# EAGLE design tweeq-eMod_IR (EAGLE 7.2.0)
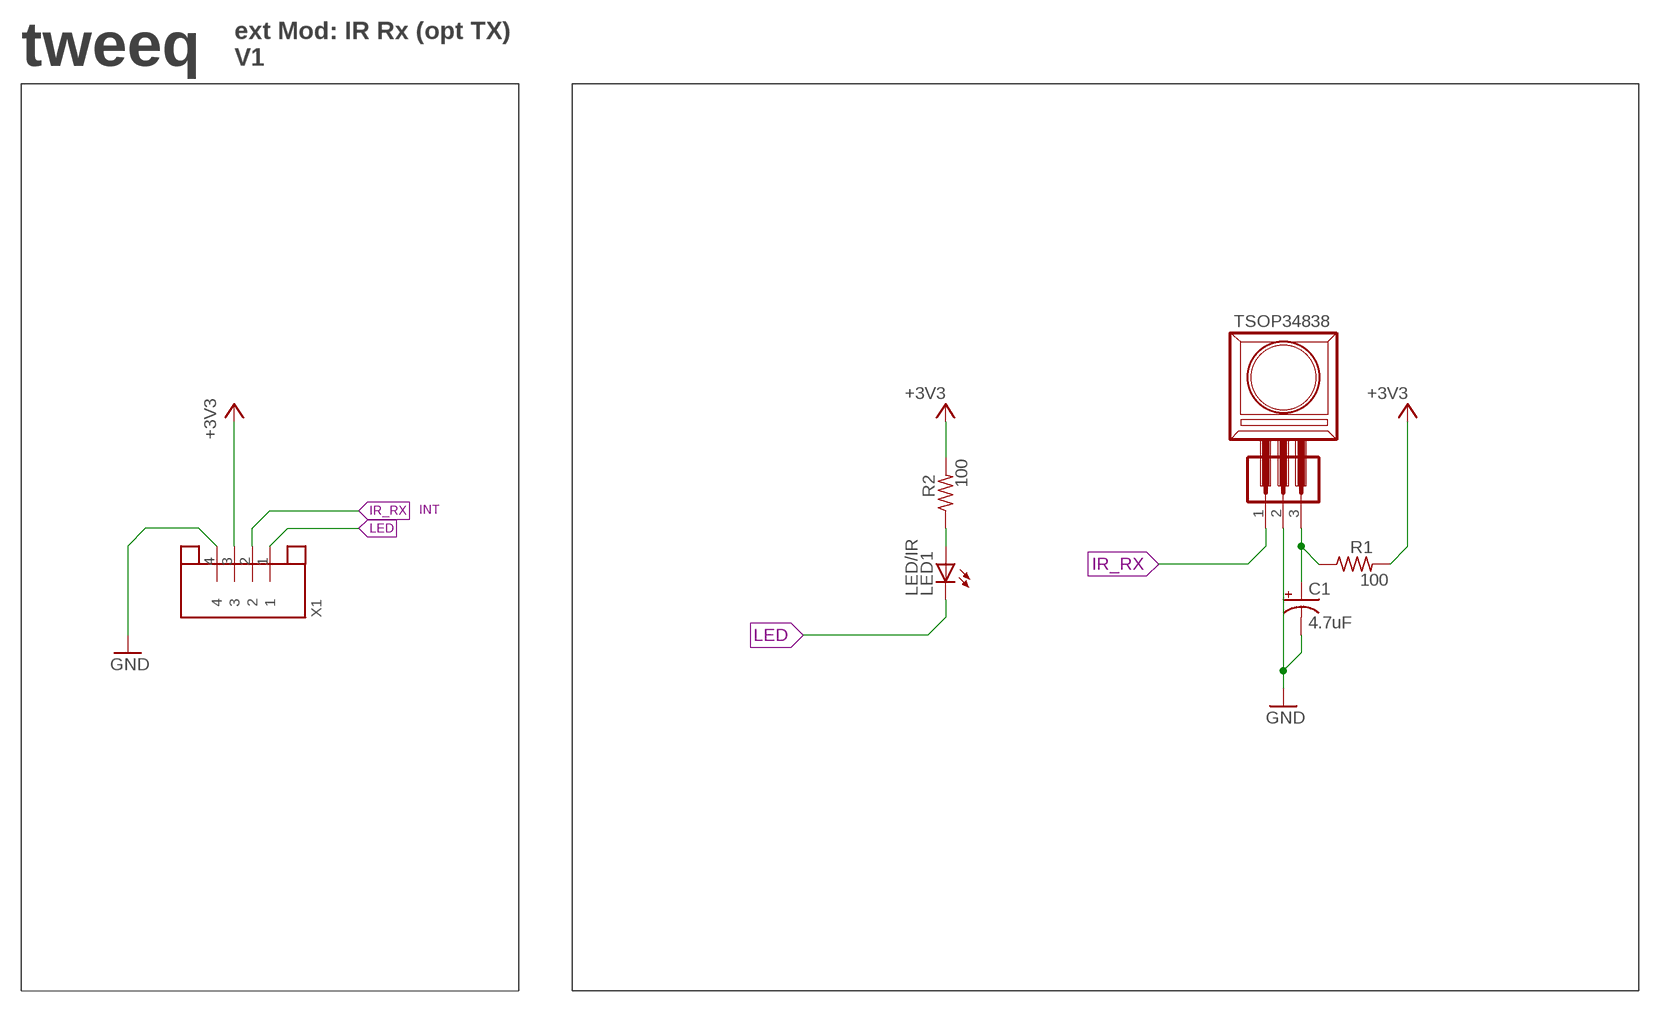
[diagram p0: schematic, sheet 1]

## Parts
C1  4.7uF  CPOL-USSMCA  [SMC_A]
LED1  LED/IR  LEDCHIPLED_0805  [CHIPLED_0805]
R1  100  R-US_R0603  [R0603]
R2  100  R-US_R0603  [R0603]
TSOP34838  M03NS-SQ  [1X03-NS-SQ]
X1  JST-4PINSH  [SH1.0-4PIN]

## Nets
+3V3: R1.2 R2.2 X1.3
GND: C1.- TSOP34838.2 X1.4
IR_RX: TSOP34838.1 X1.2
LED: LED1.C X1.1
N$1: LED1.A R2.1
N$5: C1.+ R1.1 TSOP34838.3

## Notes on the sheet
- tweeq
- ext Mod: IR Rx (opt TX)
  V1
- INT

## Library data of the parts
C1 = AISCube:CPOL-US: POLARIZED CAPACITOR, American symbol
LED1 = AISCube:LED: LED OSRAM: - CHIPLED LG R971, LG N971, LY N971, LG Q971, LY Q971, LO R971, LY R971 LH N974, LH R974 LS Q976, LO Q976, LY Q976 LO Q996 - Hyper CHIPLED LW Q18S LB Q993, LB Q99A, LB R99A - SideLED LS A670, LO A670, LY A670, LG A670, LP A670 LB A673, LV A673, LT A673, LW A673 LH A674 LY A675 LS A676, LA A676, LO A676, LY A676, LW A676 LS A679, LY A679, LG A679 - Hyper Micro SIDELED® LS Y876, LA Y876, LO Y876, LY Y876 LT Y87S - SmartLED LW L88C, LW L88S LB L89C, LB L89S, LG L890 LS L89K, LO L89K, LY L89K LS L896, LA L896, LO L896, LY L896 - TOPLED LS T670, LO T670, LY T670, LG T670, LP T670 LSG T670, LSP T670, LSY T670, LOP T670, LYG T670 LG T671, LOG T671, LSG T671 LB T673, LV T673, LT T673, LW T673 LH T674 LS T676, LA T676, LO T676, LY T676, LB T676, LH T676, LSB T676, LW T676 LB T67C, LV T67C, LT T67C, LS T67K, LO T67K, LY T67K, LW E67C LS E67B, LA E67B, LO E67B, LY E67B, LB E67C, LV E67C, LT E67C LW T67C LS T679, LY T679, LG T679 LS T770, LO T770, LY T770, LG T770, LP T770 LB T773, LV T773, LT T773, LW T773 LH T774 LS E675, LA E675, LY E675, LS T675 LS T776, LA T776, LO T776, LY T776, LB T776 LHGB T686 LT T68C, LB T68C - Hyper Mini TOPLED® LB M676 - Mini TOPLED Santana® LG M470 LS M47K, LO M47K, LY M47K Source: http://www.osram.convergy.de/
R1 R2 = rcl:R-US_: RESISTOR, American symbol
TSOP34838 = AISCube:M03: Header 3 Standard 3-pin 0.1" header
X1 = AISCube:JST-4PIN: JST 4 Pin

## Board
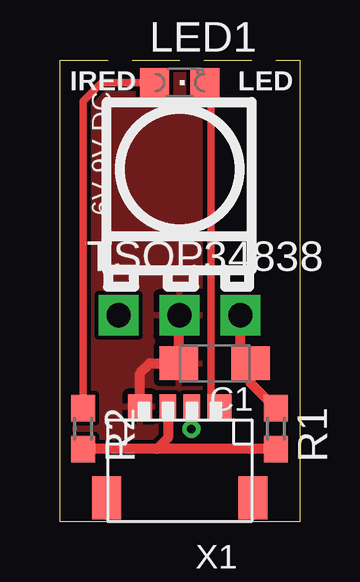
[diagram p1: board, top side]
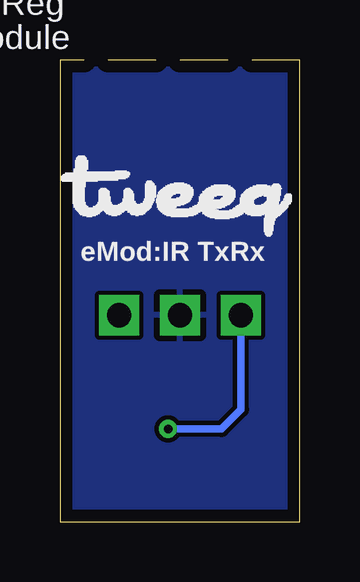
[diagram p2: board, bottom side, seen from below]

Size 10 x 19.25 mm. Coordinates in mm from the lower left corner, seen from the top.
Outline: 0,19.25 10,19.25 10,0 0,0 0,19.25
Copper layers (1*16): Top 0.0356mm / dielectric 1.5011mm / Bottom 0.0356mm
Design rules "AISCube": minimum track width 7mil, minimum drill 14mil, track to track 7mil, track to pad 7mil, pad to pad 7mil, via to via 7mil, smd to smd 0mil, copper to edge 20mil, drill to drill 8mil, minimum pad ring 10mil, minimum via ring 8mil, stop-mask expansion 4mil, vias tented up to drill 32mil, thermal gap 10mil

### Footprints (pad centres in the part's own frame; a part is rotated, then mirrored left to right if it is on the bottom)
SMC_A = smd 1.6 x 1.4: + -1.5,0; - 1.5,0
CHIPLED_0805 = smd 1.2 x 1.2: A 0,-1.05; C 0,1.05
R0603 = smd 1.1 x 1: 1 -0.85,0; 2 0.85,0
1X03-NS-SQ = drill 1.016 pad 1.676 square: 1 0,0; 2 2.54,0; 3 5.08,0
SH1.0-4PIN = smd 1 x 1: 1 -1.65,-0.55; 4 1.65,-0.55 | smd 0.7 x 1: 2 -0.5,-0.55; 3 0.5,-0.55 | smd 1.2 x 1.8: P$1 -3.05,3.25; P$2 3.05,3.25

### Placement (x,y rotation side)
C1  6.46,6.6 180 top
LED1  5,18.31 270 top
R1  9,3.88 270 top
R2  0.97,3.88 270 top
TSOP34838  2.45,8.61 0 top
U$3  [TWEEQ-LOGO-M]  9.96,11.89 0 bottom
X1  5,4.24 180 top

### Tracks (layer width: path | path; a pad name or v marks a point on that pad's centre or on a via)
+3V3
  Top 0.406: X1.3 4.5,3.48 4.04,3.03 | 4.04,3.03 R2.2 | R1.2 4.04,3.03
GND
  Top 0.406: X1.4 3.35,6.2 3.76,6.6 C1.- 4.96,8.58 TSOP34838.2
  pour Top: 9.85,19.05 9.85,0.18 0.15,0.18 0.15,19.05
  pour Bottom: 9.85,0.18 9.85,19.05 0.15,19.05 0.15,0.18
IR_RX  (via drill 0.36)
  Top 0.305: X1.2 5.5,3.87 v5.49,3.86
  Bottom 0.305: TSOP34838.1 2.44,8.6 2.44,4.67 3.25,3.86 v5.49,3.86
LED
  Top 0.305: X1.1 6.3,5.14 6.3,18.06 LED1.C
N$1
  Top 0.305: R2.1 0.97,17.53 1.75,18.31 LED1.A
N$5
  Top 0.406: R1.1 7.96,5.77 C1.+ 7.53,7.03 TSOP34838.3

### Text on the board
tPlace: IRED | LED
bPlace: eMod:IR TxRx
tNames: 6V-9V DC | ON
bNames: Breadboard | V-Reg | Module